# Altium project eDP Adapter.PrjPCB
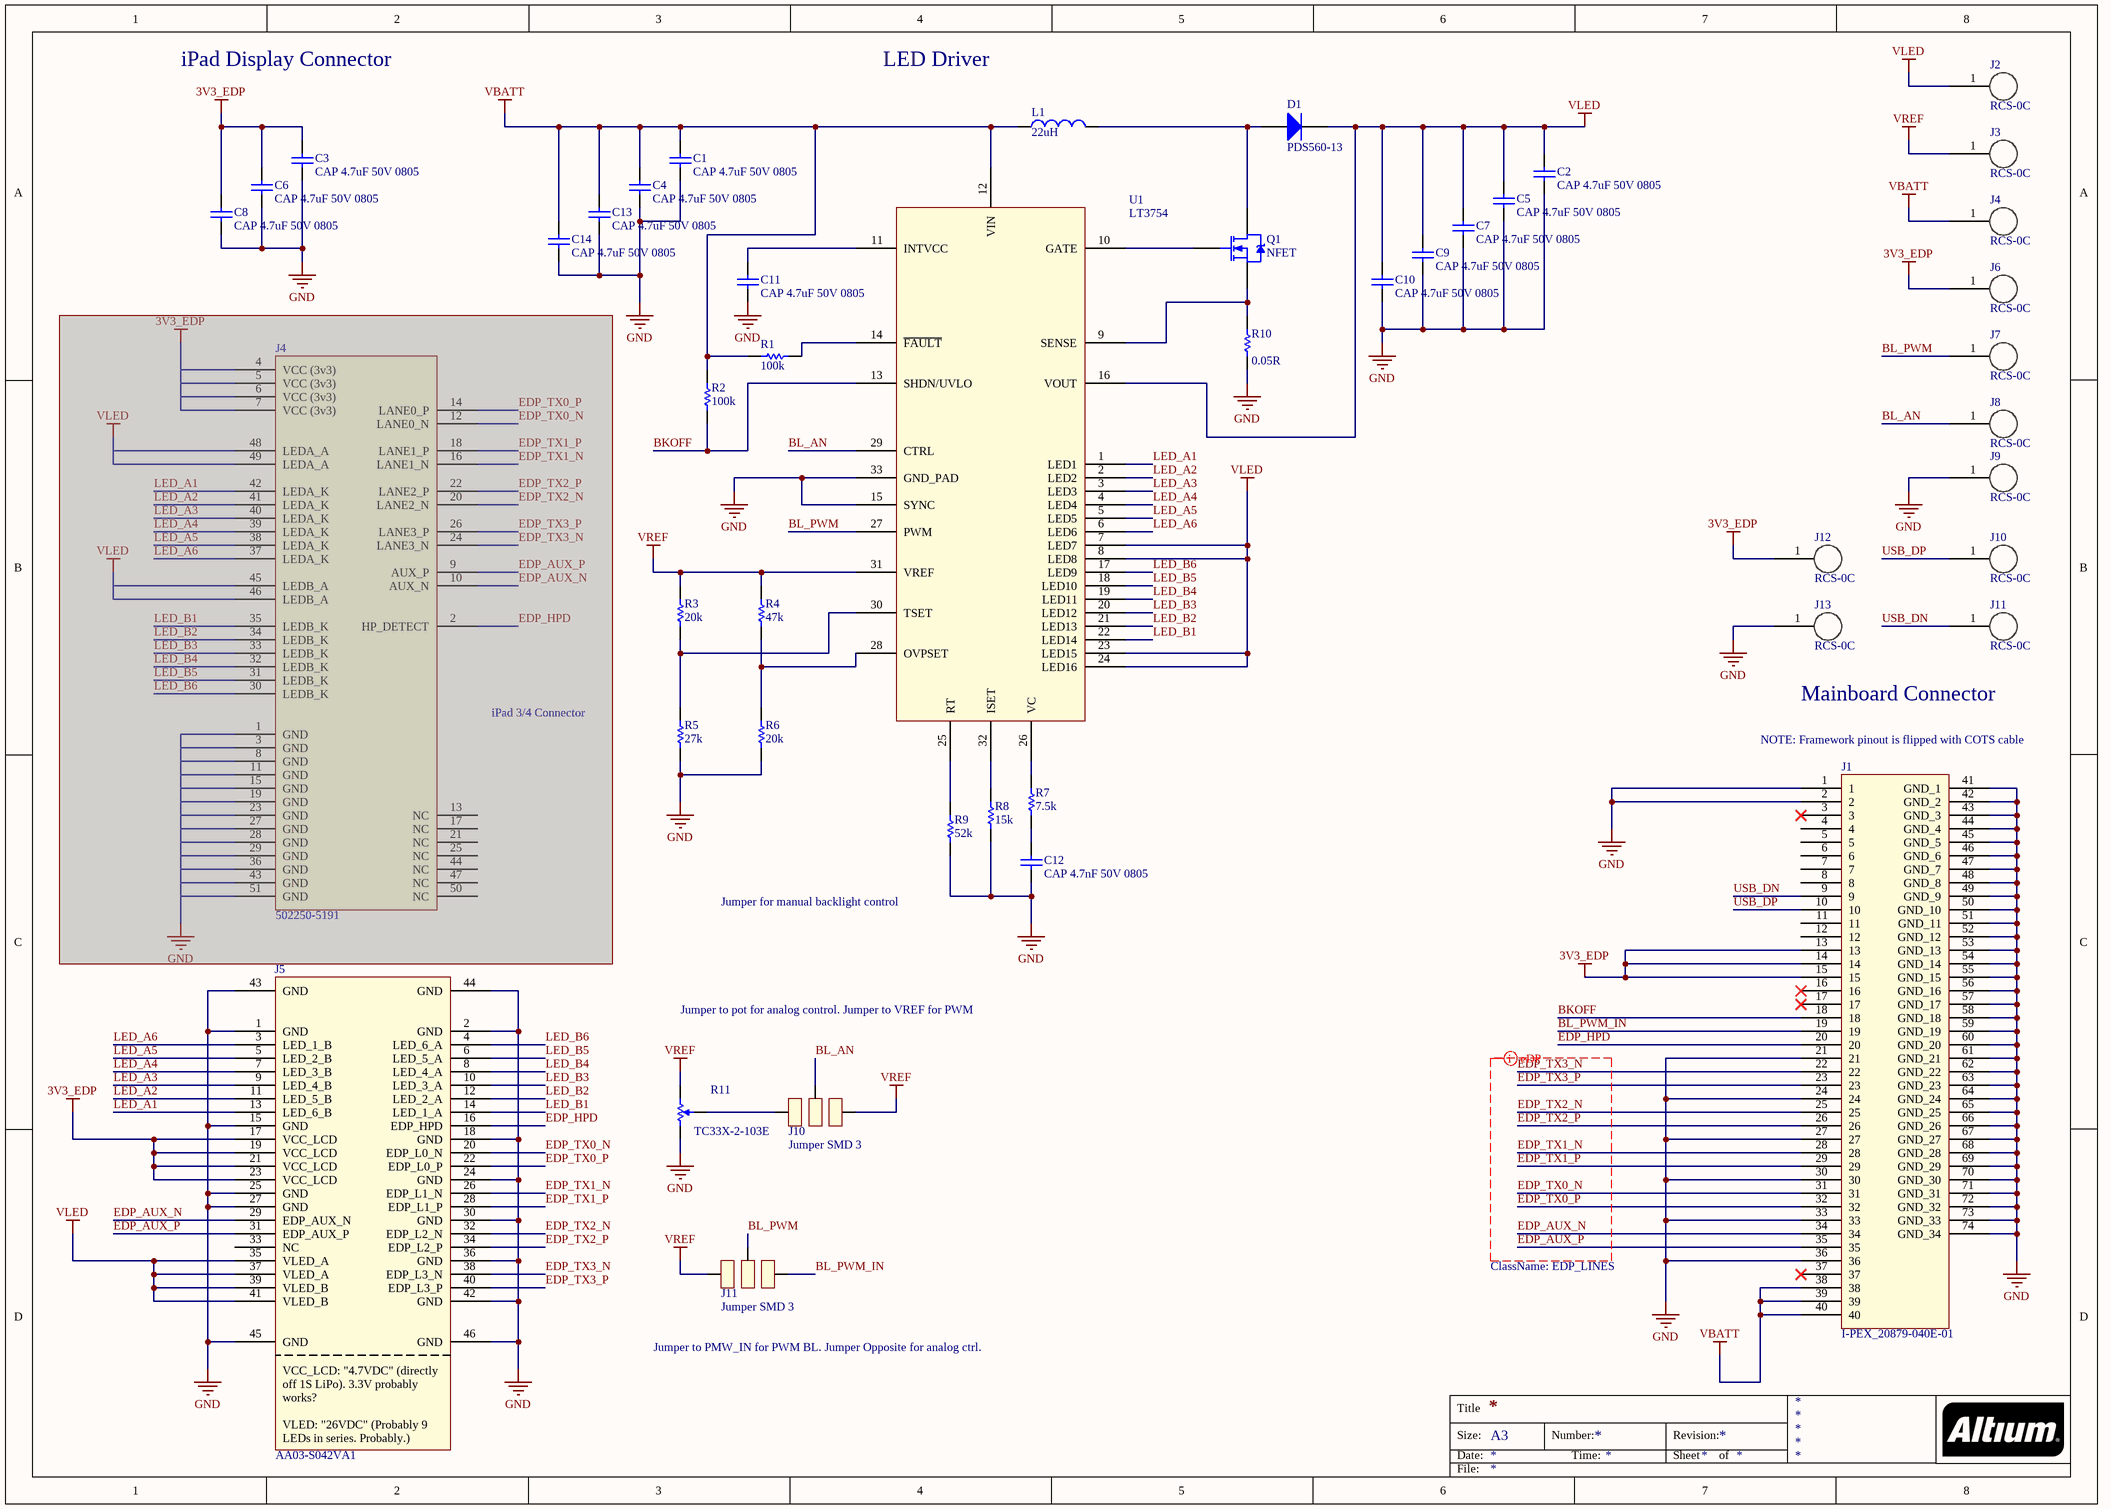
[diagram p0: eDP Adapter.SchDoc]
1 sheet, 45 parts. Net scope: global (net labels, ports and power ports of the same name join across sheets).
Board file: eDP Adapter.PcbDoc

## Sheet eDP Adapter.SchDoc
size A3

### Parts
(Parts that share a designator on the sheet are numbered #1, #2 ... from top to bottom, then left to right.)
C1  CAP 4.7uF 50V 0805  [CAPC0805(2012)145_N]
C2  CAP 4.7uF 50V 0805  [CAPC0805(2012)145_N]
C3  CAP 4.7uF 50V 0805  [CAPC0805(2012)145_N]
C4  CAP 4.7uF 50V 0805  [CAPC0805(2012)145_N]
C5  CAP 4.7uF 50V 0805  [CAPC0805(2012)145_N]
C6  CAP 4.7uF 50V 0805  [CAPC0805(2012)145_N]
C7  CAP 4.7uF 50V 0805  [CAPC0805(2012)145_N]
C8  CAP 4.7uF 50V 0805  [CAPC0805(2012)145_N]
C9  CAP 4.7uF 50V 0805  [CAPC0805(2012)145_N]
C10  CAP 4.7uF 50V 0805  [CAPC0805(2012)145_N]
C11  CAP 4.7uF 50V 0805  [CAPC0805(2012)145_N]
C12  CAP 4.7nF 50V 0805  [CAPC0805(2012)145_N]
C13  CAP 4.7uF 50V 0805  [CAPC0805(2012)145_N]
C14  CAP 4.7uF 50V 0805  [CAPC0805(2012)145_N]
D1  PDS560-13  [PDS560-13]
J1  I-PEX_20879-040E-01  [I-PEX_20879-040E-01]
J2  RCS-0C  [RCS-0C]
J3  RCS-0C  [RCS-0C]
J4#1  RCS-0C  [RCS-0C]
J4#2  502250-5191  [502250-5191]  (masked out: inside a compile mask, not in the netlist)
J5  AA03-S042VA1  [AA03-S042VA1]
J6  RCS-0C  [RCS-0C]
J7  RCS-0C  [RCS-0C]
J8  RCS-0C  [RCS-0C]
J9  RCS-0C  [RCS-0C]
J10#1  RCS-0C  [RCS-0C]
J10#2  Jumper SMD 3  [Jumper SMD 3]
J11#1  RCS-0C  [RCS-0C]
J11#2  Jumper SMD 3  [Jumper SMD 3]
J12  RCS-0C  [RCS-0C]
J13  RCS-0C  [RCS-0C]
L1  value 22uH  [INDUCTOR_6X6MM_SUMIDA_CDRH5D28]  (hidden comment: Inductor CDRH5D28)
Q1  NFET  [IRLR024NTRPBF]
R1  value 100k  [RESC0805(2012)_L]  (hidden comment: RES0805)
R2  value 100k  [RESC0805(2012)_L]  (hidden comment: RES0805)
R3  value 20k  [RESC0805(2012)_L]  (hidden comment: RES0805)
R4  value 47k  [RESC0805(2012)_L]  (hidden comment: RES0805)
R5  value 27k  [RESC0805(2012)_L]  (hidden comment: RES0805)
R6  value 20k  [RESC0805(2012)_L]  (hidden comment: RES0805)
R7  value 7.5k  [RESC0805(2012)_L]  (hidden comment: RES0805)
R8  value 15k  [RESC0805(2012)_L]  (hidden comment: RES0805)
R9  value 52k  [RESC0805(2012)_L]  (hidden comment: RES0805)
R10  value 0.05R  [2512]  (hidden comment: 2512_RES)
R11  TC33X-2-103E  [BOUR-TC33X-2_V]
U1  LT3754  [LT3754]

### Nets
3V3_EDP: C3.2 C6.2 C8.2 J1.13 J1.14 J1.15 J5.17(VCC_LCD) J5.19(VCC_LCD) J5.21(VCC_LCD) J5.23(VCC_LCD) J6.1 J12.1
GND: C1.1 C2.1 C3.1 C4.1 C5.1 C6.1 C7.1 C8.1 C9.1 C10.1 C11.1 C12.1 C13.1 C14.1 J1.1 J1.2 J1.21 J1.24 J1.27 J1.30 J1.33 J1.36 J1.41(GND_1) J1.42(GND_2) J1.43(GND_3) J1.44(GND_4) J1.45(GND_5) J1.46(GND_6) J1.47(GND_7) J1.48(GND_8) J1.49(GND_9) J1.50(GND_10) J1.51(GND_11) J1.52(GND_12) J1.53(GND_13) J1.54(GND_14) J1.55(GND_15) J1.56(GND_16) J1.57(GND_17) J1.58(GND_18) J1.59(GND_19) J1.60(GND_20) J1.61(GND_21) J1.62(GND_22) J1.63(GND_23) J1.64(GND_24) J1.65(GND_25) J1.66(GND_26) J1.67(GND_27) J1.68(GND_28) J1.69(GND_29) J1.70(GND_30) J1.71(GND_31) J1.72(GND_32) J1.73(GND_33) J1.74(GND_34) J5.1(GND) J5.2(GND) J5.15(GND) J5.18(GND) J5.24(GND) J5.25(GND) J5.27(GND) J5.30(GND) J5.36(GND) J5.42(GND) J5.43(GND) J5.44(GND) J5.45(GND) J5.46(GND) J9.1 J13.1 R5.1 R6.1 R8.1 R9.1 R10.1 R11.1 U1.15(SYNC) U1.33(GND_PAD)
VBATT: C1.2 C4.2 C13.2 C14.2 J1.38 J1.39 J1.40 J4#1.1 L1.1 R1.1 R2.2 U1.12(VIN)
VLED: C2.2 C5.2 C7.2 C9.2 C10.2 D1.K J2.1 J5.35(VLED_A) J5.37(VLED_A) J5.39(VLED_B) J5.41(VLED_B) U1.7(LED7) U1.8(LED8) U1.16(VOUT) U1.23(LED15) U1.24(LED16)
VREF: J3.1 J10#2.1 J11#2.3 R3.2 R4.2 R11.3 U1.31(VREF)
BKOFF: J1.18 R2.1 U1.13(SHDN/UVLO)
BL_AN: J8.1 J10#2.2 U1.29(CTRL)
BL_PWM: J7.1 J11#2.2 U1.27(PWM)
BL_PWM_IN: J1.19 J11#2.1
EDP_AUX_N: J1.34 J5.29(EDP_AUX_N)
EDP_AUX_P: J1.35 J5.31(EDP_AUX_P)
EDP_HPD: J1.20 J5.16(EDP_HPD)
EDP_TX0_N: J1.31 J5.20(EDP_L0_N)
EDP_TX0_P: J1.32 J5.22(EDP_L0_P)
EDP_TX1_N: J1.28 J5.26(EDP_L1_N)
EDP_TX1_P: J1.29 J5.28(EDP_L1_P)
EDP_TX2_N: J1.25 J5.32(EDP_L2_N)
EDP_TX2_P: J1.26 J5.34(EDP_L2_P)
EDP_TX3_N: J1.22 J5.38(EDP_L3_N)
EDP_TX3_P: J1.23 J5.40(EDP_L3_P)
LED_A1: J5.13(LED_6_B) U1.1(LED1)
LED_A2: J5.11(LED_5_B) U1.2(LED2)
LED_A3: J5.9(LED_4_B) U1.3(LED3)
LED_A4: J5.7(LED_3_B) U1.4(LED4)
LED_A5: J5.5(LED_2_B) U1.5(LED5)
LED_A6: J5.3(LED_1_B) U1.6(LED6)
LED_B1: J5.14(LED_1_A) U1.22(LED14)
LED_B2: J5.12(LED_2_A) U1.21(LED13)
LED_B3: J5.10(LED_3_A) U1.20(LED12)
LED_B4: J5.8(LED_4_A) U1.19(LED11)
LED_B5: J5.6(LED_5_A) U1.18(LED10)
LED_B6: J5.4(LED_6_A) U1.17(LED9)
USB_DN: J1.9 J11#1.1
USB_DP: J1.10 J10#1.1
NetC11_2: C11.2 U1.11(INTVCC)
NetC12_2: C12.2 R7.1
NetD1_A: D1.A L1.2 Q1.4(D)
NetJ10#2_3: J10#2.3 R11.2
NetQ1_1: Q1.1(G) U1.10(GATE)
NetQ1_3: Q1.3(S) R10.2 U1.9(SENSE)
NetR1_2: R1.2 U1.14(~{FAULT})
NetR3_1: R3.1 R5.2 U1.30(TSET)
NetR4_1: R4.1 R6.2 U1.28(OVPSET)
NetR7_2: R7.2 U1.26(VC)
NetR8_2: R8.2 U1.32(ISET)
NetR9_2: R9.2 U1.25(RT)

Not connected (* = marked no-connect by the designer): J1 3* 4 5 6 7 8 11 12 16* 17* 37*; J5 33(NC)

### Layout directives
differential pair; net class EDP_LINES: EDP_AUX_N, EDP_AUX_P, EDP_TX0_N, EDP_TX0_P, EDP_TX1_N, EDP_TX1_P, EDP_TX2_N, EDP_TX2_P, EDP_TX3_N, EDP_TX3_P

### Notes on the sheet
- iPad Display Connector
- LED Driver
- iPad 3/4 Connector
- Mainboard Connector
- (near J1) NOTE: Framework pinout is flipped with COTS cable
- Jumper for manual backlight control
- Jumper to pot for analog control. Jumper to VREF for PWM
- Jumper to PMW_IN for PWM BL. Jumper Opposite for analog ctrl.
- Title
- Size:
- Date:
- A3
- Number:
- Time:
- Revision:
- Sheet
- of
- File:
- (in symbol AA03-S042VA1) VCC_LCD: "4.7VDC" (directly off 1S LiPo). 3.3V probably works? / VLED: "26VDC" (Probably 9 LEDs in series. Probably.)

### Library data of the parts
C1-C14 = CMP-1036-04752-1: CAP 1uF 25V ±5% 0805 (2012 Metric) Thickness 1.45mm SMD; Case-EIA: 0805; Case-Metric: 2012; Tolerance: Â±5%; Rated Voltage: 25 V; Value: 1uF; Technology: SMT; Max Thickness: 1.45 mm
R1-R9 = CMP-1591-00002-1: 0805 (2012 Metric) Chip Resistor; Case-EIA: 0805; Case-Metric: 2012; PackageReference: RESC0805(2012)
R11 = CMP-2100-03695-1: Trimming Potentiometer, 10000 Ohm, -40 to 100 degC, 3-Pin SMD, RoHS, Tape and Reel; Manufacturer: Bourns; Tolerance: 25%; Max Power Dissipation: 100mW; Number of Turns: 1; Resistance: 10KOhm; Temperature Coefficient: 250ppm/degreesC; Voltage Rating (DC): 50V; Datasheet URL: http://www.bourns.com/docs/Product-Datasheets/TC33.pdf; Composition: Potentiometer; Package Description: 3-Pin Surface Mount Device, Body 3.8 x 3.6 mm; Weight: 29.4mg; Power Rating: 100mW; Termination: FootPrint; Manufacturer URL: http://www.bourns.com/; Width: 0.118inch; Height: 0.047inch; Military Standard: Not; Radiation Hardening: No; Colour: Silver; Case/Package: SMD/SMT; Depth: 3.8mm; Min Operating Temperature: -40degC; Lead Free: LeadFree; Datasheet Version: 42583.0; REACH SVHC: NoSVHC; Length: 3mm; RoHSCompliant: true; Contact Plating: Silver; Taper: Linear; Packaging: TapeandReel; Mount: SurfaceMount; Max Operating Temperature: 100degC; Package Reference: TC33X-2; Package Quantity: 2500